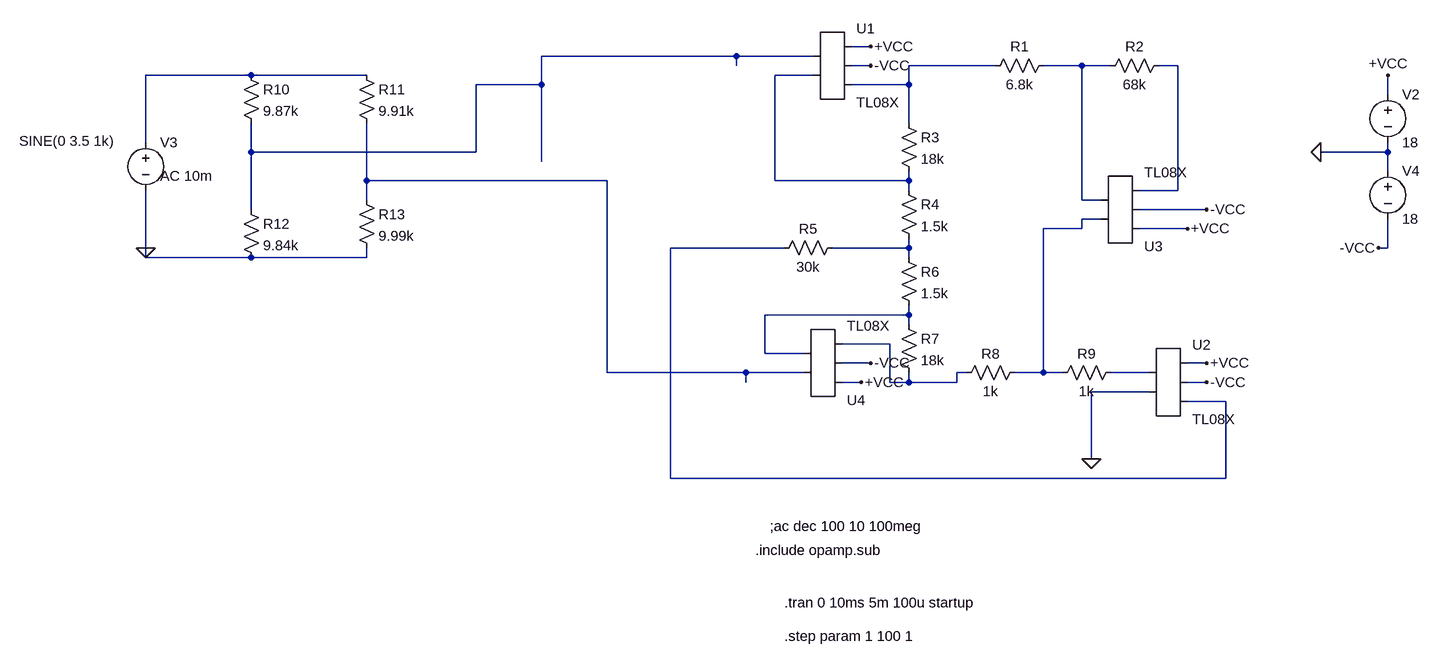
[diagram p0: schematic Todo_real.asc]
Todo_real.asc, the LTspice schematic file:
Version 4
SHEET 1 1480 904
WIRE 160 -96 128 -96
WIRE -64 -80 -512 -80
WIRE 64 -80 -64 -80
WIRE -64 -64 -64 -80
WIRE 160 -64 128 -64
WIRE 368 -64 224 -64
WIRE 512 -64 448 -64
WIRE 560 -64 512 -64
WIRE 672 -64 640 -64
WIRE -1536 -48 -1712 -48
WIRE -1312 -48 -1536 -48
WIRE 64 -48 0 -48
WIRE -512 -32 -512 -80
WIRE -512 -32 -640 -32
WIRE 224 -32 224 -64
WIRE 224 -32 128 -32
WIRE 1424 -16 1424 -48
WIRE 224 32 224 -32
WIRE -1712 64 -1712 -48
WIRE -1536 80 -1536 32
WIRE -640 80 -640 -32
WIRE -640 80 -1536 80
WIRE 1424 80 1424 64
WIRE 1424 80 1312 80
WIRE -512 96 -512 -32
WIRE 1424 112 1424 80
WIRE -1312 128 -1312 32
WIRE -400 128 -1312 128
WIRE 0 128 0 -48
WIRE 224 128 224 112
WIRE 224 128 0 128
WIRE 224 144 224 128
WIRE 672 144 672 -64
WIRE 672 144 608 144
WIRE -1312 160 -1312 128
WIRE 512 160 512 -64
WIRE 544 160 512 160
WIRE -1536 176 -1536 80
WIRE 720 176 608 176
WIRE 544 192 512 192
WIRE 512 208 512 192
WIRE 512 208 448 208
WIRE 688 208 608 208
WIRE -1712 240 -1712 144
WIRE 16 240 -272 240
WIRE 224 240 224 224
WIRE 224 240 96 240
WIRE 1424 240 1424 192
WIRE 1424 240 1408 240
WIRE -1712 256 -1712 240
WIRE -1536 256 -1712 256
WIRE -1312 256 -1312 240
WIRE -1312 256 -1536 256
WIRE 224 256 224 240
WIRE 224 352 224 336
WIRE 224 352 -16 352
WIRE 224 368 224 352
WIRE 192 400 112 400
WIRE -16 416 -16 352
WIRE 48 416 -16 416
WIRE 160 432 112 432
WIRE 720 432 688 432
WIRE -400 448 -400 128
WIRE -48 448 -400 448
WIRE 48 448 -48 448
WIRE 320 448 304 448
WIRE 448 448 448 208
WIRE 448 448 400 448
WIRE 480 448 448 448
WIRE 624 448 560 448
WIRE -48 464 -48 448
WIRE 144 464 112 464
WIRE 192 464 192 400
WIRE 224 464 224 448
WIRE 224 464 192 464
WIRE 304 464 304 448
WIRE 304 464 224 464
WIRE 720 464 688 464
WIRE 624 480 528 480
WIRE 752 496 688 496
WIRE 528 592 528 480
WIRE -272 624 -272 240
WIRE 752 624 752 496
WIRE 752 624 -272 624
FLAG 528 592 0
FLAG 1424 -48 +VCC
FLAG 720 432 +VCC
FLAG 1408 240 -VCC
FLAG 720 464 -VCC
FLAG 1312 80 0
FLAG 688 208 +VCC
FLAG 720 176 -VCC
FLAG 144 464 +VCC
FLAG 160 432 -VCC
FLAG 160 -96 +VCC
FLAG 160 -64 -VCC
FLAG -1712 240 0
SYMBOL res 464 -80 R90
WINDOW 0 0 56 VBottom 2
WINDOW 3 32 56 VTop 2
SYMATTR InstName R1
SYMATTR Value 6.8k
SYMBOL res 656 -80 R90
WINDOW 0 0 56 VBottom 2
WINDOW 3 32 56 VTop 2
SYMATTR InstName R2
SYMATTR Value 68k
SYMBOL res 208 16 R0
SYMATTR InstName R3
SYMATTR Value 18k
SYMBOL res 208 128 R0
SYMATTR InstName R4
SYMATTR Value 1.5k
SYMBOL res 112 224 R90
WINDOW 0 0 56 VBottom 2
WINDOW 3 32 56 VTop 2
SYMATTR InstName R5
SYMATTR Value 30k
SYMBOL res 208 240 R0
SYMATTR InstName R6
SYMATTR Value 1.5k
SYMBOL res 208 352 R0
SYMATTR InstName R7
SYMATTR Value 18k
SYMBOL res 416 432 R90
WINDOW 0 0 56 VBottom 2
WINDOW 3 32 56 VTop 2
SYMATTR InstName R8
SYMATTR Value 1k
SYMBOL res 576 432 R90
WINDOW 0 0 56 VBottom 2
WINDOW 3 32 56 VTop 2
SYMATTR InstName R9
SYMATTR Value 1k
SYMBOL voltage -1712 48 R0
WINDOW 3 -211 14 Left 2
WINDOW 123 24 72 Left 2
WINDOW 39 0 0 Left 0
SYMATTR Value SINE(0 3.5 1k)
SYMATTR Value2 AC 10m
SYMATTR InstName V3
SYMBOL AutoGenerated\\TL08X 656 464 R0
SYMATTR InstName U2
SYMBOL voltage 1424 -32 R0
WINDOW 123 0 0 Left 0
WINDOW 39 0 0 Left 0
SYMATTR InstName V2
SYMATTR Value 18
SYMBOL voltage 1424 96 R0
WINDOW 123 0 0 Left 0
WINDOW 39 0 0 Left 0
SYMATTR InstName V4
SYMATTR Value 18
SYMBOL AutoGenerated\\TL08X 576 176 M180
SYMATTR InstName U3
SYMBOL AutoGenerated\\TL08X 96 -64 R0
SYMATTR InstName U1
SYMBOL AutoGenerated\\TL08X 80 432 M180
SYMATTR InstName U4
SYMBOL res -1552 -64 R0
SYMATTR InstName R10
SYMATTR Value 9.87k
SYMBOL res -1328 -64 R0
SYMATTR InstName R11
SYMATTR Value 9.91k
SYMBOL res -1552 160 R0
SYMATTR InstName R12
SYMATTR Value 9.84k
SYMBOL res -1328 144 R0
SYMATTR InstName R13
SYMATTR Value 9.99k
TEXT -32 744 Left 2 !.include opamp.sub
TEXT -8 704 Left 2 !;ac dec 100 10 100meg
TEXT 16 832 Left 2 !.tran 0 10ms 5m 100u startup
TEXT 16 888 Left 2 !.step param 1 100 1

The netlist it stands for:
* Todo_real.asc
R1 N003 N002 6.8k
R2 N004 N003 68k
R3 N002 N006 18k
R4 N006 N010 1.5k
R5 N010 N009 30k
R6 N010 N011 1.5k
R7 N011 N012 18k
R8 N008 N012 1k
R9 N013 N008 1k
V3 N005 0 SINE(0 3.5 1k) AC 10m
* U2: TL08X (symbol AutoGenerated\TL08X not available, pins judged from their places): pin1=N013 pin2=0 pin3=+VCC pin4=-VCC pin5=N009
V2 +VCC 0 18
V4 0 -VCC 18
* U3: TL08X (symbol AutoGenerated\TL08X not available, pins judged from their places): pin1=N008 pin2=N003 pin3=+VCC pin4=-VCC pin5=N004
* U1: TL08X (symbol AutoGenerated\TL08X not available, pins judged from their places): pin1=N001 pin2=N006 pin3=+VCC pin4=-VCC pin5=N002
* U4: TL08X (symbol AutoGenerated\TL08X not available, pins judged from their places): pin1=N007 pin2=N011 pin3=+VCC pin4=-VCC pin5=N012
R10 N005 N001 9.87k
R11 N005 N007 9.91k
R12 N001 0 9.84k
R13 N007 0 9.99k
.include opamp.sub
;ac dec 100 10 100meg
.tran 0 10ms 5m 100u startup
.step param 1 100 1
.backanno
.end